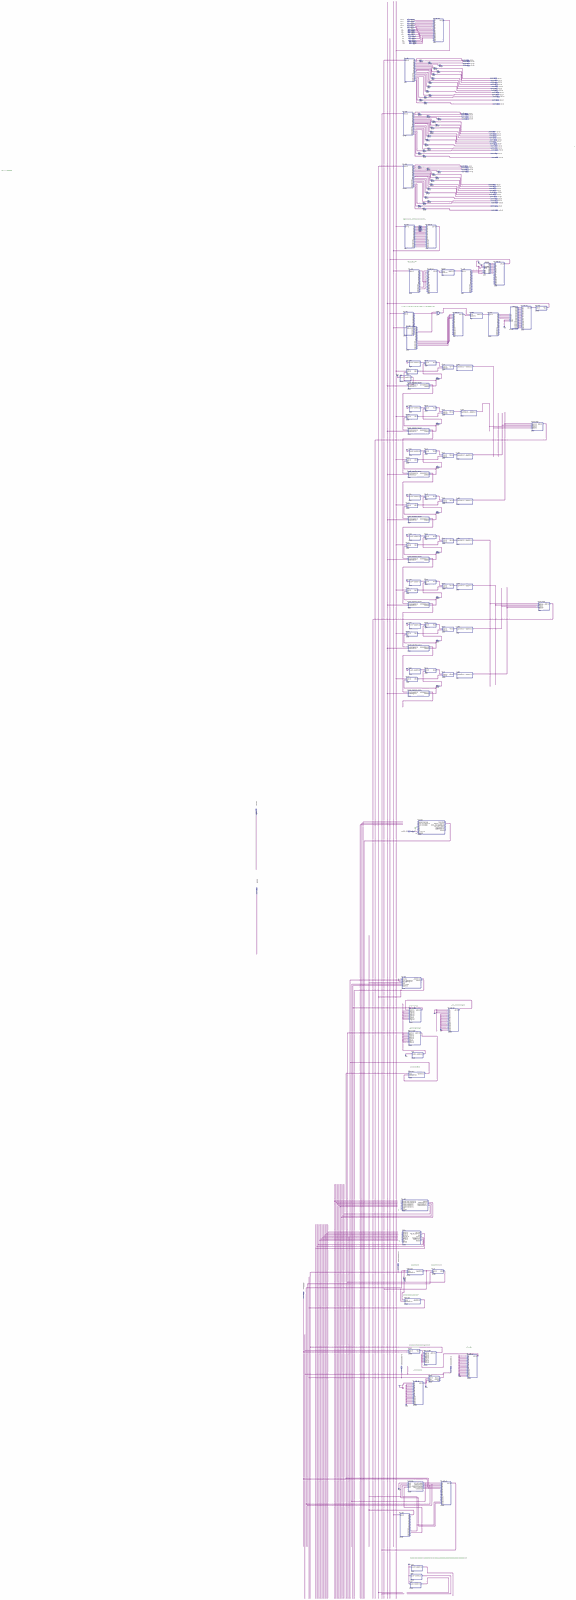
[diagram p0: schematic sheet, whole]
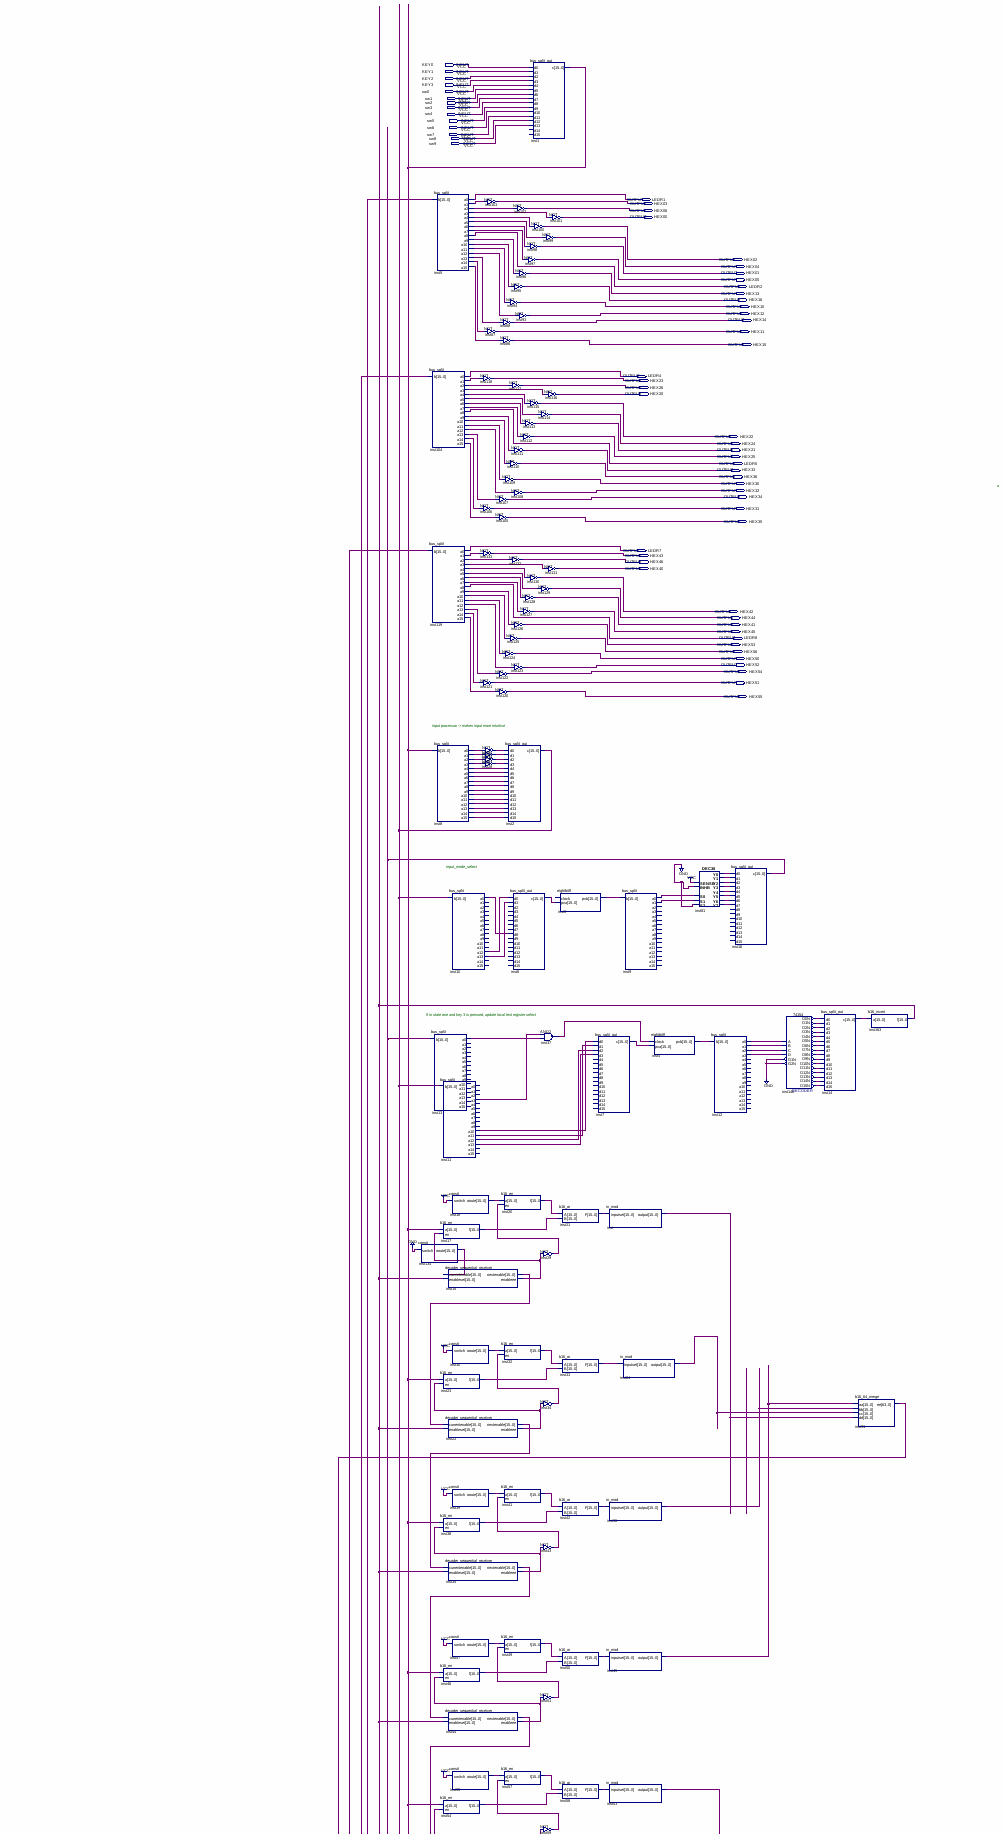
[diagram p1: schematic sheet, upper right part]
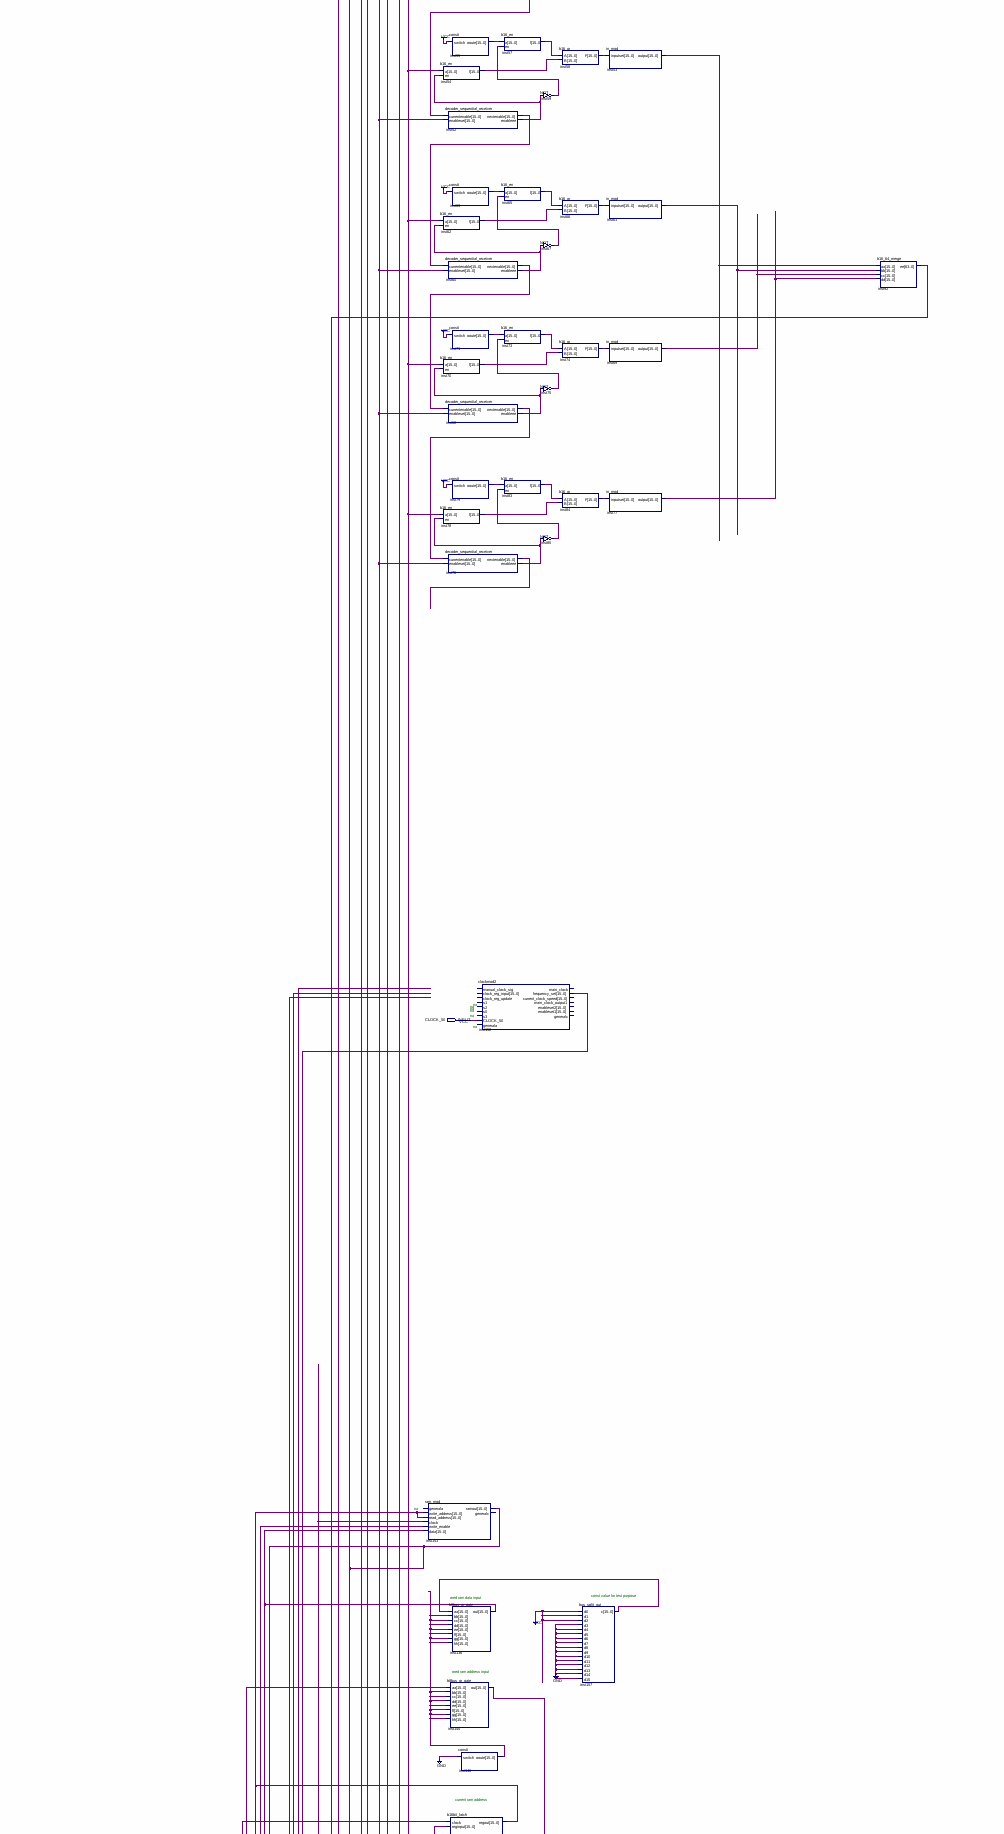
[diagram p2: schematic sheet, middle right part]
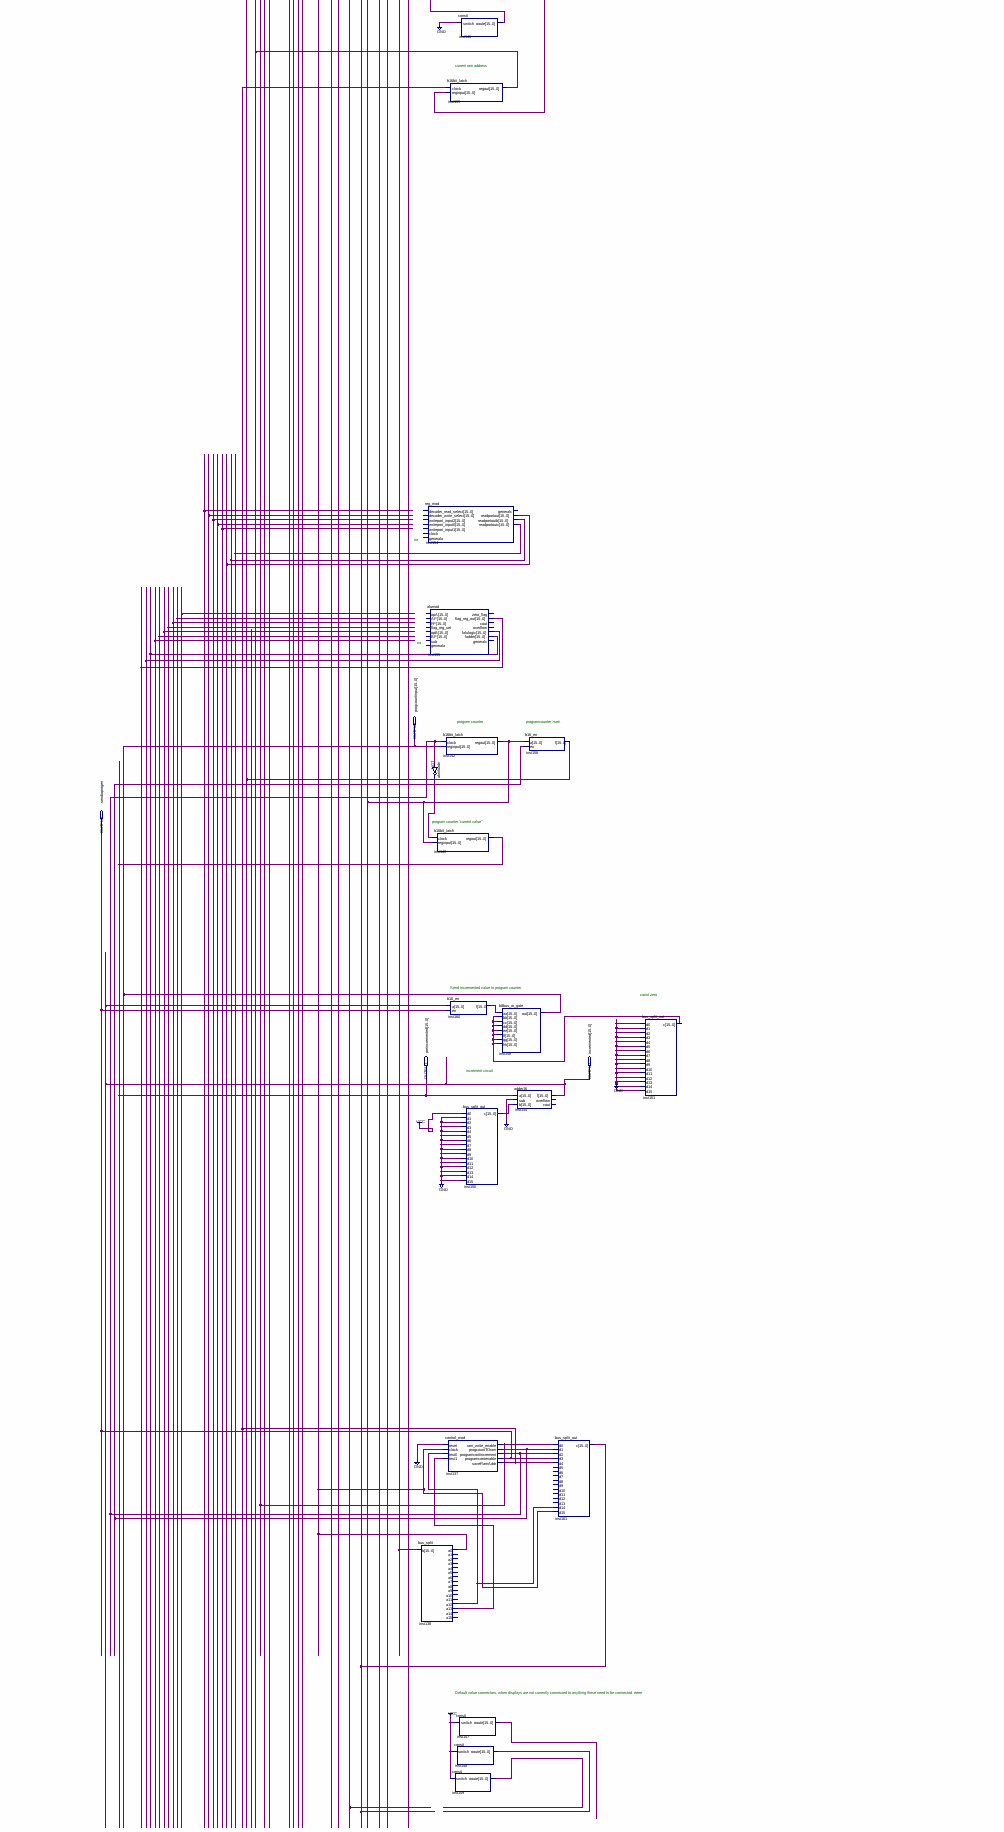
[diagram p3: schematic sheet, lower right part]
// Quartus schematic processor.bdf as structural Verilog: 150 symbols, 69 pins
module processor (
  input  KEY0,
  input  KEY1,
  input  KEY2,
  input  KEY3,
  input  sw0,
  input  sw1,
  input  sw2,
  input  sw3,
  input  sw4,
  input  sw5,
  input  sw6,
  input  sw7,
  input  sw8,
  input  sw9,
  input  generala,
  input  CLOCK_50,
  output LEDR1,
  output HEX03,
  output HEX06,
  output HEX00,
  output HEX02,
  output HEX04,
  output HEX01,
  output HEX05,
  output LEDR2,
  output HEX13,
  output HEX16,
  output HEX10,
  output HEX12,
  output HEX14,
  output HEX11,
  output HEX15,
  output LEDR4,
  output HEX23,
  output HEX26,
  output HEX20,
  output HEX22,
  output HEX24,
  output HEX21,
  output HEX25,
  output LEDR5,
  output HEX33,
  output HEX36,
  output HEX30,
  output HEX32,
  output HEX34,
  output HEX31,
  output HEX35,
  output LEDR7,
  output HEX43,
  output HEX46,
  output HEX40,
  output HEX42,
  output HEX44,
  output HEX41,
  output HEX45,
  output LEDR8,
  output HEX53,
  output HEX56,
  output HEX50,
  output HEX52,
  output HEX54,
  output HEX51,
  output HEX55,
  output generalc,
  output [15:0] progcountinput,
  output sendtoprogen,
  output [15:0] preincremented,
  output [15:0] incremented
);

  wire akmfoadn_out, inst5_a1, inst5_a2, inst5_a3, inst5_a4, inst5_a5, inst5_a6, inst5_a7, inst5_a9,
       inst5_a10, inst5_a11, inst5_a12, inst5_a13, inst5_a14, inst5_a15, inst8_a0, inst8_a1, inst8_a2,
       inst8_a3, inst8_a4, inst8_a5, inst8_a6, inst8_a7, inst8_a8, inst8_a9, inst8_a10, inst8_a11, inst8_a12,
       inst8_a13, inst8_a14, inst8_a15, inst9_a0, inst9_a1, inst10_a0, inst10_a12, inst10_a13, inst11_a3,
       inst11_a10, inst11_a11, inst11_a12, inst11_a13, inst12_a0, inst12_a1, inst12_a2, inst12_a3, inst13_a0,
       inst15_enableee, inst22_enableee, inst25_out, inst26_out, inst27_out, inst28_out, inst29_out,
       inst34_out, inst35_enableee, inst37_out, inst43_out, inst44_enableee, inst51_out, inst52_enableee,
       inst59_out, inst60_enableee, inst67_out, inst68_enableee, inst75_out, inst76_enableee, inst81_y0,
       inst81_y1, inst81_y2, inst81_y3, inst81_y4, inst81_y5, inst81_y6, inst81_y7, inst85_out, inst104_a1,
       inst104_a2, inst104_a3, inst104_a4, inst104_a5, inst104_a6, inst104_a7, inst104_a9, inst104_a10,
       inst104_a11, inst104_a12, inst104_a13, inst104_a14, inst104_a15, inst119_a1, inst119_a2, inst119_a3,
       inst119_a4, inst119_a5, inst119_a6, inst119_a7, inst119_a9, inst119_a10, inst119_a11, inst119_a12,
       inst119_a13, inst119_a14, inst119_a15, inst137_progcounttoram, inst137_programcontincrement,
       inst137_ram_write_enable, inst137_saveramaddr, inst138_a0, inst138_a12, inst138_a13, inst140_o0n,
       inst140_o1n, inst140_o2n, inst140_o3n, inst140_o4n, inst140_o5n, inst140_o6n, inst140_o7n,
       inst140_o8n, inst140_o9n, inst140_o10n, inst140_o11n, inst140_o12n, inst140_o13n, inst140_o14n,
       inst140_o15n;
  wire [15:0] inst1_c, inst2_c, inst3_pxb, inst4_pxb, inst6_c, inst7_c, inst14_c, inst15_nextenable,
       inst16_c, inst17_f, inst18_ooute, inst20_f, inst21_f, inst22_nextenable, inst23_f, inst24_output,
       inst30_ooute, inst32_f, inst33_f, inst35_nextenable, inst36_output, inst38_f, inst39_ooute, inst41_f,
       inst42_f, inst44_nextenable, inst45_output, inst46_f, inst47_ooute, inst49_f, inst50_f,
       inst52_nextenable, inst53_output, inst54_f, inst55_ooute, inst57_f, inst58_f, inst60_nextenable,
       inst61_output, inst62_f, inst63_ooute, inst65_f, inst66_f, inst68_nextenable, inst69_output, inst70_f,
       inst71_ooute, inst73_f, inst74_f, inst76_nextenable, inst77_output, inst78_f, inst79_ooute, inst83_f,
       inst84_f, inst134_ooute, inst136_out, inst142_regout, inst145_out, inst146_ooute, inst147_ooute,
       inst148_ooute, inst149_ooute, inst150_c, inst151_c, inst152_frequency_set, inst153_ramout,
       inst154_readportout, inst154_readportoutb, inst154_readportoutc, inst155_fadder, inst155_falulogic,
       inst155_flag_reg_out, inst156_f, inst157_c, inst159_regout, inst160_f, inst161_c, inst163_f,
       inst_output;
  wire [63:0] inst91_ee, inst92_ee;

  constt inst134 (.switch(1'b0), .ooute(inst134_ooute));
  ram_mod inst153 (
    .write_address(inst159_regout), .read_address(inst159_regout), .clock(inst138_a0),
    .write_enable(inst137_ram_write_enable), .data(inst136_out), .ramout(inst153_ramout));  // open: generala, generalc
  reg_mod inst154 (
    .readportout(inst154_readportout), .readportoutb(inst154_readportoutb),
    .readportoutc(inst154_readportoutc));  // open: decoder_read_select, decoder_write_select, writeport_input2, writeport_input0, writeport_input1, clock, generala, generalc
  alumod inst155 (
    .flag_reg_out(inst155_flag_reg_out), .falulogic(inst155_falulogic), .fadder(inst155_fadder));  // open: opA, AP, FP, flag_reg_set, opB, BP, sub, generala, zero_flag, cout, overflow, generalc
  bus_split inst138 (
    .b(inst2_c), .a0(inst138_a0), .a12(inst138_a12), .a13(inst138_a13));  // open: a1, a2, a3, a4, a5, a6, a7, a8, a9, a10, a11, a14, a15
  bus_split inst5 (
    .b(inst142_regout), .a0(LEDR1), .a1(inst5_a1), .a2(inst5_a2), .a3(inst5_a3), .a4(inst5_a4),
    .a5(inst5_a5), .a6(inst5_a6), .a7(inst5_a7), .a8(LEDR2), .a9(inst5_a9), .a10(inst5_a10), .a11(inst5_a11),
    .a12(inst5_a12), .a13(inst5_a13), .a14(inst5_a14), .a15(inst5_a15));
  bus_split inst104 (
    .b(inst161_c), .a0(LEDR4), .a1(inst104_a1), .a2(inst104_a2), .a3(inst104_a3), .a4(inst104_a4),
    .a5(inst104_a5), .a6(inst104_a6), .a7(inst104_a7), .a8(LEDR5), .a9(inst104_a9), .a10(inst104_a10),
    .a11(inst104_a11), .a12(inst104_a12), .a13(inst104_a13), .a14(inst104_a14), .a15(inst104_a15));
  bus_split inst119 (
    .b(inst153_ramout), .a0(LEDR7), .a1(inst119_a1), .a2(inst119_a2), .a3(inst119_a3), .a4(inst119_a4),
    .a5(inst119_a5), .a6(inst119_a6), .a7(inst119_a7), .a8(LEDR8), .a9(inst119_a9), .a10(inst119_a10),
    .a11(inst119_a11), .a12(inst119_a12), .a13(inst119_a13), .a14(inst119_a14), .a15(inst119_a15));
  bus_split inst8 (
    .b(inst1_c), .a0(inst8_a0), .a1(inst8_a1), .a2(inst8_a2), .a3(inst8_a3), .a4(inst8_a4), .a5(inst8_a5),
    .a6(inst8_a6), .a7(inst8_a7), .a8(inst8_a8), .a9(inst8_a9), .a10(inst8_a10), .a11(inst8_a11),
    .a12(inst8_a12), .a13(inst8_a13), .a14(inst8_a14), .a15(inst8_a15));
  bus_split inst13 (
    .b(inst16_c), .a0(inst13_a0));  // open: a1, a2, a3, a4, a5, a6, a7, a8, a9, a10, a11, a12, a13, a14, a15
  bus_split inst11 (
    .b(inst2_c), .a3(inst11_a3), .a10(inst11_a10), .a11(inst11_a11), .a12(inst11_a12), .a13(inst11_a13));  // open: a0, a1, a2, a4, a5, a6, a7, a8, a9, a14, a15
  b16_en inst17 (.a(inst1_c), .en(inst15_enableee), .f(inst17_f));
  decoder_sequential_receiver inst15 (
    .currentenable(inst134_ooute), .enableset(inst163_f), .nextenable(inst15_nextenable),
    .enableee(inst15_enableee));
  b16_en inst23 (.a(inst1_c), .en(inst22_enableee), .f(inst23_f));
  decoder_sequential_receiver inst22 (
    .currentenable(inst15_nextenable), .enableset(inst163_f), .nextenable(inst22_nextenable),
    .enableee(inst22_enableee));
  b16_en inst38 (.a(inst1_c), .en(inst35_enableee), .f(inst38_f));
  decoder_sequential_receiver inst35 (
    .currentenable(inst22_nextenable), .enableset(inst163_f), .nextenable(inst35_nextenable),
    .enableee(inst35_enableee));
  b16_en inst46 (.a(inst1_c), .en(inst44_enableee), .f(inst46_f));
  decoder_sequential_receiver inst44 (
    .currentenable(inst35_nextenable), .enableset(inst163_f), .nextenable(inst44_nextenable),
    .enableee(inst44_enableee));
  b16_en inst54 (.a(inst1_c), .en(inst52_enableee), .f(inst54_f));
  decoder_sequential_receiver inst52 (
    .currentenable(inst44_nextenable), .enableset(inst163_f), .nextenable(inst52_nextenable),
    .enableee(inst52_enableee));
  b16_en inst62 (.a(inst1_c), .en(inst60_enableee), .f(inst62_f));
  decoder_sequential_receiver inst60 (
    .currentenable(inst52_nextenable), .enableset(inst163_f), .nextenable(inst60_nextenable),
    .enableee(inst60_enableee));
  b16_en inst70 (.a(inst1_c), .en(inst68_enableee), .f(inst70_f));
  decoder_sequential_receiver inst68 (
    .currentenable(inst60_nextenable), .enableset(inst163_f), .nextenable(inst68_nextenable),
    .enableee(inst68_enableee));
  b16_en inst78 (.a(inst1_c), .en(inst76_enableee), .f(inst78_f));
  decoder_sequential_receiver inst76 (
    .currentenable(inst68_nextenable), .enableset(inst163_f), .nextenable(inst76_nextenable),
    .enableee(inst76_enableee));
  b16bit_latch inst142 (.clock(inst137_programcontincrement), .reginput(progcountinput), .regout(inst142_regout));
  not akmfoadn (akmfoadn_out, inst137_programcontincrement);
  b16bit_latch inst143 (.clock(akmfoadn_out), .reginput(inst142_regout), .regout(preincremented));
  control_mod inst137 (
    .reset(1'b0), .clock(inst138_a0), .test0(inst138_a12), .test1(inst138_a13),
    .ram_write_enable(inst137_ram_write_enable), .progcountTOram(inst137_progcounttoram),
    .programcontincrement(inst137_programcontincrement), .programcontenable(sendtoprogen),
    .saveRamAddr(inst137_saveramaddr));
  bus_split inst10 (
    .b(inst2_c), .a0(inst10_a0), .a12(inst10_a12), .a13(inst10_a13));  // open: a1, a2, a3, a4, a5, a6, a7, a8, a9, a10, a11, a14, a15
  constt inst18 (.switch(1'b1), .ooute(inst18_ooute));
  constt inst30 (.switch(1'b1), .ooute(inst30_ooute));
  constt inst39 (.switch(1'b1), .ooute(inst39_ooute));
  constt inst47 (.switch(1'b1), .ooute(inst47_ooute));
  constt inst55 (.switch(1'b1), .ooute(inst55_ooute));
  constt inst63 (.switch(1'b1), .ooute(inst63_ooute));
  constt inst71 (.switch(1'b1), .ooute(inst71_ooute));
  constt inst79 (.switch(1'b1), .ooute(inst79_ooute));
  b8bus_or_gate inst136 (
    .aa(inst157_c), .bb(inst146_ooute), .cc(inst146_ooute), .dd(inst146_ooute), .ee(inst146_ooute),
    .ff(inst146_ooute), .gg(inst146_ooute), .hh(inst146_ooute), .out(inst136_out));
  b8bus_or_gate inst145 (
    .aa(inst156_f), .bb(inst146_ooute), .cc(inst146_ooute), .dd(inst146_ooute), .ee(inst146_ooute),
    .ff(inst146_ooute), .gg(inst146_ooute), .hh(inst146_ooute), .out(inst145_out));
  constt inst146 (.switch(1'b0), .ooute(inst146_ooute));
  b16bit_latch inst159 (.clock(inst137_saveramaddr), .reginput(inst145_out), .regout(inst159_regout));
  b16_en inst160 (.a(incremented), .en(sendtoprogen), .f(inst160_f));
  bus_split_out inst150 (
    .d0(1'b1), .d1(1'b0), .d2(1'b0), .d3(1'b0), .d4(1'b0), .d5(1'b0), .d6(1'b0), .d7(1'b0), .d8(1'b0),
    .d9(1'b0), .d10(1'b0), .d11(1'b0), .d12(1'b0), .d13(1'b0), .d14(1'b0), .d15(1'b0), .c(inst150_c));
  constt inst147 (.switch(1'b1), .ooute(inst147_ooute));
  constt inst148 (.switch(1'b1), .ooute(inst148_ooute));
  constt inst149 (.switch(1'b1), .ooute(inst149_ooute));
  not inst118 (HEX23, inst104_a1);
  not inst106 (HEX31, inst104_a14);
  not inst133 (HEX43, inst119_a1);
  not inst121 (HEX51, inst119_a14);
  clockmod2 inst152 (
    .CLOCK_50(CLOCK_50), .frequency_set(inst152_frequency_set));  // open: manual_clock_sig, clock_reg_input, clock_reg_update, s1, s2, s0, s3, generala, main_clock, current_clock_speed, main_clock_output1, enableset2, enableset1, generalc
  not inst103 (HEX03, inst5_a1);
  not inst87 (HEX11, inst5_a14);
  not inst107 (HEX34, inst104_a13);
  not inst105 (HEX35, inst104_a15);
  not inst122 (HEX54, inst119_a13);
  not inst120 (HEX55, inst119_a15);
  not inst25 (inst25_out, inst8_a0);
  not inst26 (inst26_out, inst8_a1);
  not inst27 (inst27_out, inst8_a2);
  not inst28 (inst28_out, inst8_a3);
  b8bus_or_gate inst158 (
    .aa(inst160_f), .bb(inst151_c), .cc(inst151_c), .dd(inst151_c), .ee(inst151_c), .ff(inst151_c),
    .gg(inst151_c), .hh(inst151_c), .out(progcountinput));
  not inst102 (HEX06, inst5_a2);
  not inst96 (HEX13, inst5_a9);
  not inst95 (HEX16, inst5_a10);
  not inst94 (HEX10, inst5_a11);
  not inst93 (HEX12, inst5_a12);
  not inst88 (HEX14, inst5_a13);
  not inst86 (HEX15, inst5_a15);
  not inst117 (HEX26, inst104_a2);
  not inst111 (HEX33, inst104_a9);
  not inst110 (HEX36, inst104_a10);
  not inst109 (HEX30, inst104_a11);
  not inst108 (HEX32, inst104_a12);
  not inst132 (HEX46, inst119_a2);
  not inst126 (HEX53, inst119_a9);
  not inst125 (HEX56, inst119_a10);
  not inst124 (HEX50, inst119_a11);
  not inst123 (HEX52, inst119_a12);
  bus_split_out inst2 (
    .d0(inst25_out), .d1(inst26_out), .d2(inst27_out), .d3(inst28_out), .d4(inst8_a4), .d5(inst8_a5),
    .d6(inst8_a6), .d7(inst8_a7), .d8(inst8_a8), .d9(inst8_a9), .d10(inst8_a10), .d11(inst8_a11),
    .d12(inst8_a12), .d13(inst8_a13), .d14(inst8_a14), .d15(inst8_a15), .c(inst2_c));
  bus_split_out inst6 (
    .d0(inst10_a12), .d1(inst10_a13), .d8(inst10_a0), .c(inst6_c));  // open: d2, d3, d4, d5, d6, d7, d9, d10, d11, d12, d13, d14, d15
  b16_en inst20 (.a(inst18_ooute), .en(inst29_out), .f(inst20_f));
  b16_en inst32 (.a(inst30_ooute), .en(inst34_out), .f(inst32_f));
  b16_en inst41 (.a(inst39_ooute), .en(inst43_out), .f(inst41_f));
  b16_en inst49 (.a(inst47_ooute), .en(inst51_out), .f(inst49_f));
  b16_en inst57 (.a(inst55_ooute), .en(inst59_out), .f(inst57_f));
  b16_en inst65 (.a(inst63_ooute), .en(inst67_out), .f(inst65_f));
  b16_en inst73 (.a(inst71_ooute), .en(inst75_out), .f(inst73_f));
  b16_en inst83 (.a(inst79_ooute), .en(inst85_out), .f(inst83_f));
  adder16 inst144 (.a(preincremented), .sub(1'b0), .b(inst150_c), .f(incremented));  // open: overflow, cout
  bus_split_out inst1 (
    .d0(KEY0), .d1(KEY1), .d2(KEY2), .d3(KEY3), .d4(sw0), .d5(sw1), .d6(sw2), .d7(sw3), .d8(sw4), .d9(sw5),
    .d10(sw6), .d11(sw7), .d12(sw8), .d13(sw9), .c(inst1_c));  // open: d14, d15
  not inst100 (HEX02, inst5_a4);
  not inst98 (HEX01, inst5_a6);
  not inst97 (HEX05, inst5_a7);
  not inst115 (HEX22, inst104_a4);
  not inst113 (HEX21, inst104_a6);
  not inst112 (HEX25, inst104_a7);
  not inst130 (HEX42, inst119_a4);
  not inst128 (HEX41, inst119_a6);
  not inst127 (HEX45, inst119_a7);
  b16_en inst156 (.a(inst142_regout), .en(inst137_progcounttoram), .f(inst156_f));
  not inst101 (HEX00, inst5_a3);
  not inst99 (HEX04, inst5_a5);
  not inst116 (HEX20, inst104_a3);
  not inst114 (HEX24, inst104_a5);
  not inst131 (HEX40, inst119_a3);
  not inst129 (HEX44, inst119_a5);
  and inst37 (inst37_out, inst11_a3, inst13_a0);
  not inst29 (inst29_out, inst15_enableee);
  not inst34 (inst34_out, inst22_enableee);
  not inst43 (inst43_out, inst35_enableee);
  not inst51 (inst51_out, inst44_enableee);
  not inst59 (inst59_out, inst52_enableee);
  not inst67 (inst67_out, inst60_enableee);
  not inst75 (inst75_out, inst68_enableee);
  not inst85 (inst85_out, inst76_enableee);
  eightbitff inst3 (.pxa(inst6_c), .pxb(inst3_pxb));  // open: clock
  b16_or inst21 (.A(inst20_f), .B(inst17_f), .F(inst21_f));
  b16_or inst33 (.A(inst32_f), .B(inst23_f), .F(inst33_f));
  b16_or inst42 (.A(inst41_f), .B(inst38_f), .F(inst42_f));
  b16_or inst50 (.A(inst49_f), .B(inst46_f), .F(inst50_f));
  b16_or inst58 (.A(inst57_f), .B(inst54_f), .F(inst58_f));
  b16_or inst66 (.A(inst65_f), .B(inst62_f), .F(inst66_f));
  b16_or inst74 (.A(inst73_f), .B(inst70_f), .F(inst74_f));
  b16_or inst84 (.A(inst83_f), .B(inst78_f), .F(inst84_f));
  bus_split_out inst161 (
    .d0(inst137_ram_write_enable), .d1(inst137_progcounttoram), .d2(inst137_programcontincrement),
    .d3(sendtoprogen), .d4(inst137_saveramaddr), .d14(inst138_a12), .d15(inst138_a0), .c(inst161_c));  // open: d5, d6, d7, d8, d9, d10, d11, d12, d13
  bus_split_out inst157 (
    .d0(1'b1), .d1(1'b1), .d2(1'b1), .d3(1'b0), .d4(1'b0), .d5(1'b0), .d6(1'b0), .d7(1'b0), .d8(1'b0),
    .d9(1'b0), .d10(1'b0), .d11(1'b0), .d12(1'b0), .d13(1'b0), .d14(1'b0), .d15(1'b0), .c(inst157_c));
  bus_split_out inst7 (
    .d0(inst11_a10), .d1(inst11_a11), .d2(inst11_a12), .d3(inst11_a13), .c(inst7_c));  // open: d4, d5, d6, d7, d8, d9, d10, d11, d12, d13, d14, d15
  in_mod inst (.inputset(inst21_f), .\output (inst_output));
  in_mod inst36 (.inputset(inst42_f), .\output (inst36_output));
  in_mod inst45 (.inputset(inst50_f), .\output (inst45_output));
  in_mod inst53 (.inputset(inst58_f), .\output (inst53_output));
  in_mod inst61 (.inputset(inst66_f), .\output (inst61_output));
  in_mod inst69 (.inputset(inst74_f), .\output (inst69_output));
  in_mod inst77 (.inputset(inst84_f), .\output (inst77_output));
  bus_split inst9 (
    .b(inst3_pxb), .a0(inst9_a0), .a1(inst9_a1));  // open: a2, a3, a4, a5, a6, a7, a8, a9, a10, a11, a12, a13, a14, a15
  in_mod inst24 (.inputset(inst33_f), .\output (inst24_output));
  bus_split_out inst151 (
    .d0(1'b0), .d1(1'b0), .d2(1'b0), .d3(1'b0), .d4(1'b0), .d5(1'b0), .d6(1'b0), .d7(1'b0), .d8(1'b0),
    .d9(1'b0), .d10(1'b0), .d11(1'b0), .d12(1'b0), .d13(1'b0), .d14(1'b0), .d15(1'b0), .c(inst151_c));
  eightbitff inst4 (.clock(inst37_out), .pxa(inst7_c), .pxb(inst4_pxb));
  DEC38 inst81 (
    .S2(1'b0), .S1(inst9_a1), .INHB(1'b0), .S0(inst9_a0), .SENSE(1'b1), .Y7(inst81_y7), .Y6(inst81_y6),
    .Y5(inst81_y5), .Y3(inst81_y3), .Y4(inst81_y4), .Y0(inst81_y0), .Y1(inst81_y1), .Y2(inst81_y2));
  bus_split inst12 (
    .b(inst4_pxb), .a0(inst12_a0), .a1(inst12_a1), .a2(inst12_a2), .a3(inst12_a3));  // open: a4, a5, a6, a7, a8, a9, a10, a11, a12, a13, a14, a15
  bus_split_out inst16 (
    .d0(inst81_y0), .d1(inst81_y1), .d2(inst81_y2), .d3(inst81_y3), .d4(inst81_y4), .d5(inst81_y5),
    .d6(inst81_y6), .d7(inst81_y7), .c(inst16_c));  // open: d8, d9, d10, d11, d12, d13, d14, d15
  \74154  inst140 (
    .C(inst12_a2), .D(inst12_a3), .B(inst12_a1), .A(inst12_a0), .G1N(1'b0), .G2N(1'b0), .O0N(inst140_o0n),
    .O12N(inst140_o12n), .O15N(inst140_o15n), .O10N(inst140_o10n), .O11N(inst140_o11n), .O1N(inst140_o1n),
    .O13N(inst140_o13n), .O14N(inst140_o14n), .O4N(inst140_o4n), .O3N(inst140_o3n), .O2N(inst140_o2n),
    .O7N(inst140_o7n), .O6N(inst140_o6n), .O5N(inst140_o5n), .O9N(inst140_o9n), .O8N(inst140_o8n));
  bus_split_out inst14 (
    .d0(inst140_o0n), .d1(inst140_o1n), .d2(inst140_o2n), .d3(inst140_o3n), .d4(inst140_o4n),
    .d5(inst140_o5n), .d6(inst140_o6n), .d7(inst140_o7n), .d8(inst140_o8n), .d9(inst140_o9n),
    .d10(inst140_o10n), .d11(inst140_o11n), .d12(inst140_o12n), .d13(inst140_o13n), .d14(inst140_o14n),
    .d15(inst140_o15n), .c(inst14_c));
  b16_64_merge inst91 (.aa(inst45_output), .bb(inst36_output), .cc(inst24_output), .dd(inst_output), .ee(inst91_ee));
  b16_invert inst163 (.a(inst14_c), .f(inst163_f));
  b16_64_merge inst92 (.aa(inst53_output), .bb(inst61_output), .cc(inst69_output), .dd(inst77_output), .ee(inst92_ee));

  // Notes on the sheet:
  //   a
  //   processor input/output    
  //   input processor -> makes input more intuitive
  //   input_mode_select
  //   If in state one and key 3 is pressed, update local test register select 
  //   na
  //   na
  //   na
  //   na
  //   na
  //   na
  //   na
  //   const value for test purpose
  //   ored ram data input
  //   ored ram address input
  //   current ram address
  //   na
  //   na
  //   program counter
  //   programcounter->ram
  //   program counter "current value"
  //   Send incremented value to program counter
  //   const zero 
  //   increment circuit
  //   Default value connectors, when displays are not currently connected to anything these need to be connected  eeee
endmodule
